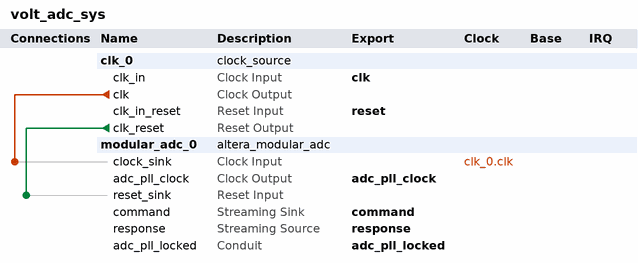
[diagram p0: system contents]
# Platform Designer (Qsys) system volt_adc_sys
# Parameters at their usual value, and those the tool derives, are not listed.
package require -exact qsys 17.0
create_system volt_adc_sys

add_instance clk_0 clock_source 17.0
set_instance_parameter_value clk_0 clockFrequency 50000000

add_instance modular_adc_0 altera_modular_adc 17.1
set_instance_parameter_value modular_adc_0 NUM_CHANNELS 1
set_instance_parameter_value modular_adc_0 SEQUENCER_TYPE STANDARD
set_instance_parameter_value modular_adc_0 TSE_ENABLE 0
set_instance_parameter_value modular_adc_0 PRESCALAR 10
set_instance_parameter_value modular_adc_0 CHANNEL_SETTING_NUMBER_0 SINGLE_ENDED
set_instance_parameter_value modular_adc_0 SAMPLE_STORE_ENABLED 0

# connections
add_connection clk_0.clk modular_adc_0.clock_sink clock
add_connection clk_0.clk_reset modular_adc_0.reset_sink reset

# exported interfaces
add_interface clk clock sink
set_interface_property clk EXPORT_OF clk_0.clk_in
add_interface reset reset sink
set_interface_property reset EXPORT_OF clk_0.clk_in_reset
add_interface adc_pll_clock clock source
set_interface_property adc_pll_clock EXPORT_OF modular_adc_0.adc_pll_clock
add_interface adc_pll_locked conduit end
set_interface_property adc_pll_locked EXPORT_OF modular_adc_0.adc_pll_locked
add_interface command avalon_streaming sink
set_interface_property command EXPORT_OF modular_adc_0.command
add_interface response avalon_streaming source
set_interface_property response EXPORT_OF modular_adc_0.response

save_system volt_adc_sys.qsys
